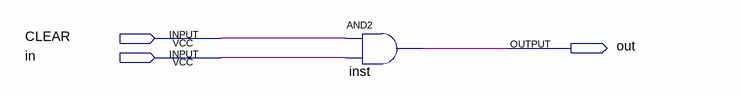
[diagram p0: schematic sheet]
// Quartus schematic CLEAR.bdf as structural Verilog: 1 symbols, 3 pins
module CLEAR (
  input  CLEAR,
  input  in,
  output out
);

  and inst (out, CLEAR, in);
endmodule
